# Altium schematic sheet Pushbuttons.SchDoc
size A4; DocumentNumber: 17; SheetNumber: ALT0056; SheetTotal: 21
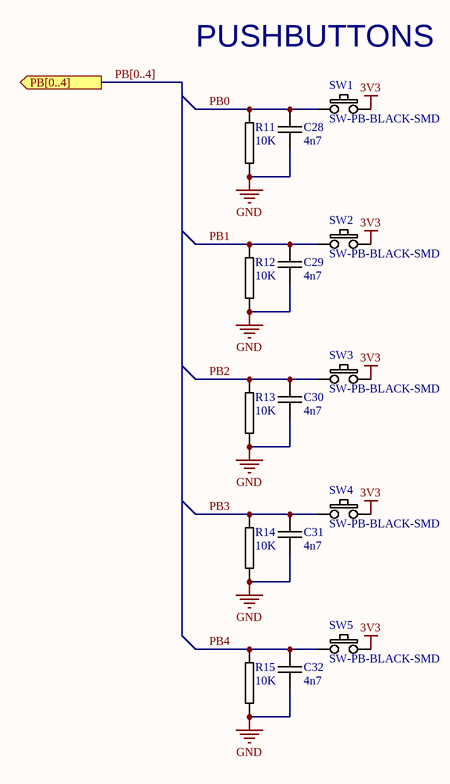
[diagram p0: Pushbuttons.SchDoc]

## Parts
C28  4n7  [0603C-TBD]
C29  4n7  [0603C-TBD]
C30  4n7  [0603C-TBD]
C31  4n7  [0603C-TBD]
C32  4n7  [0603C-TBD]
R11  10K  [0603R-10K]
R12  10K  [0603R-10K]
R13  10K  [0603R-10K]
R14  10K  [0603R-10K]
R15  10K  [0603R-10K]
SW1  SW-PB-BLACK-SMD  [SW-PB-SMD]
SW2  SW-PB-BLACK-SMD  [SW-PB-SMD]
SW3  SW-PB-BLACK-SMD  [SW-PB-SMD]
SW4  SW-PB-BLACK-SMD  [SW-PB-SMD]
SW5  SW-PB-BLACK-SMD  [SW-PB-SMD]

## Ports
PB[0..4] (out)

## Nets
3V3: SW1.2 SW2.2 SW3.2 SW4.2 SW5.2
GND: C28.2 C29.2 C30.2 C31.2 C32.2 R11.2 R12.2 R13.2 R14.2 R15.2
PB0: C28.1 R11.1 SW1.1
PB1: C29.1 R12.1 SW2.1
PB2: C30.1 R13.1 SW3.1
PB3: C31.1 R14.1 SW4.1
PB4: C32.1 R15.1 SW5.1

## Buses and harness runs
bus PB[0..4] = port PB[0..4]

## Notes on the sheet
- PUSHBUTTONS
- Title
- Size:
- Date:
- A4
- Number:
- Time:
- Revision:
- Sheet
- of
- File:

## Library data of the parts
C28-C32 = 0603C-4N7: CAPACITOR 0603 CERAMIC; REEL: C83; Supplier 1: Digi-Key; Supplier Part Number 1: 445-5086-2-ND
R11-R15 = 0603R-10K: GENERIC RESISTOR 0603; Manufacturer: Stackpole Electronics Inc; Manufacturer Part Number: RMCF 1/16 10K 1% R; Tolerance: ±1%; Power (Watts): 0.1W, 1/10W; Temperature Coefficient: ±100ppm/°C; Resistance In Ohms: 10.0K; Reel: R21; Category: Resistors; Supplier Part Number: RMCF1/1610KFRDKR-ND; Lead Style: Surface Mount (SMD - SMT); RoHS: RoHS Compliant; Packaging: Digi-Reel®; Case: 0603 (1608 metric); Composition: Thick Film; Supplier: Digi-Key; Supplier 1: Digi-Key; Supplier Part Number 1: RMCF0603FT10K0DKR-ND
SW1-SW5 = SW-PB-BLACK-SMD: PUSHBUTTON SWITCH 6MM SMD